# EAGLE design placa_servo2 (EAGLE 8.0.0)
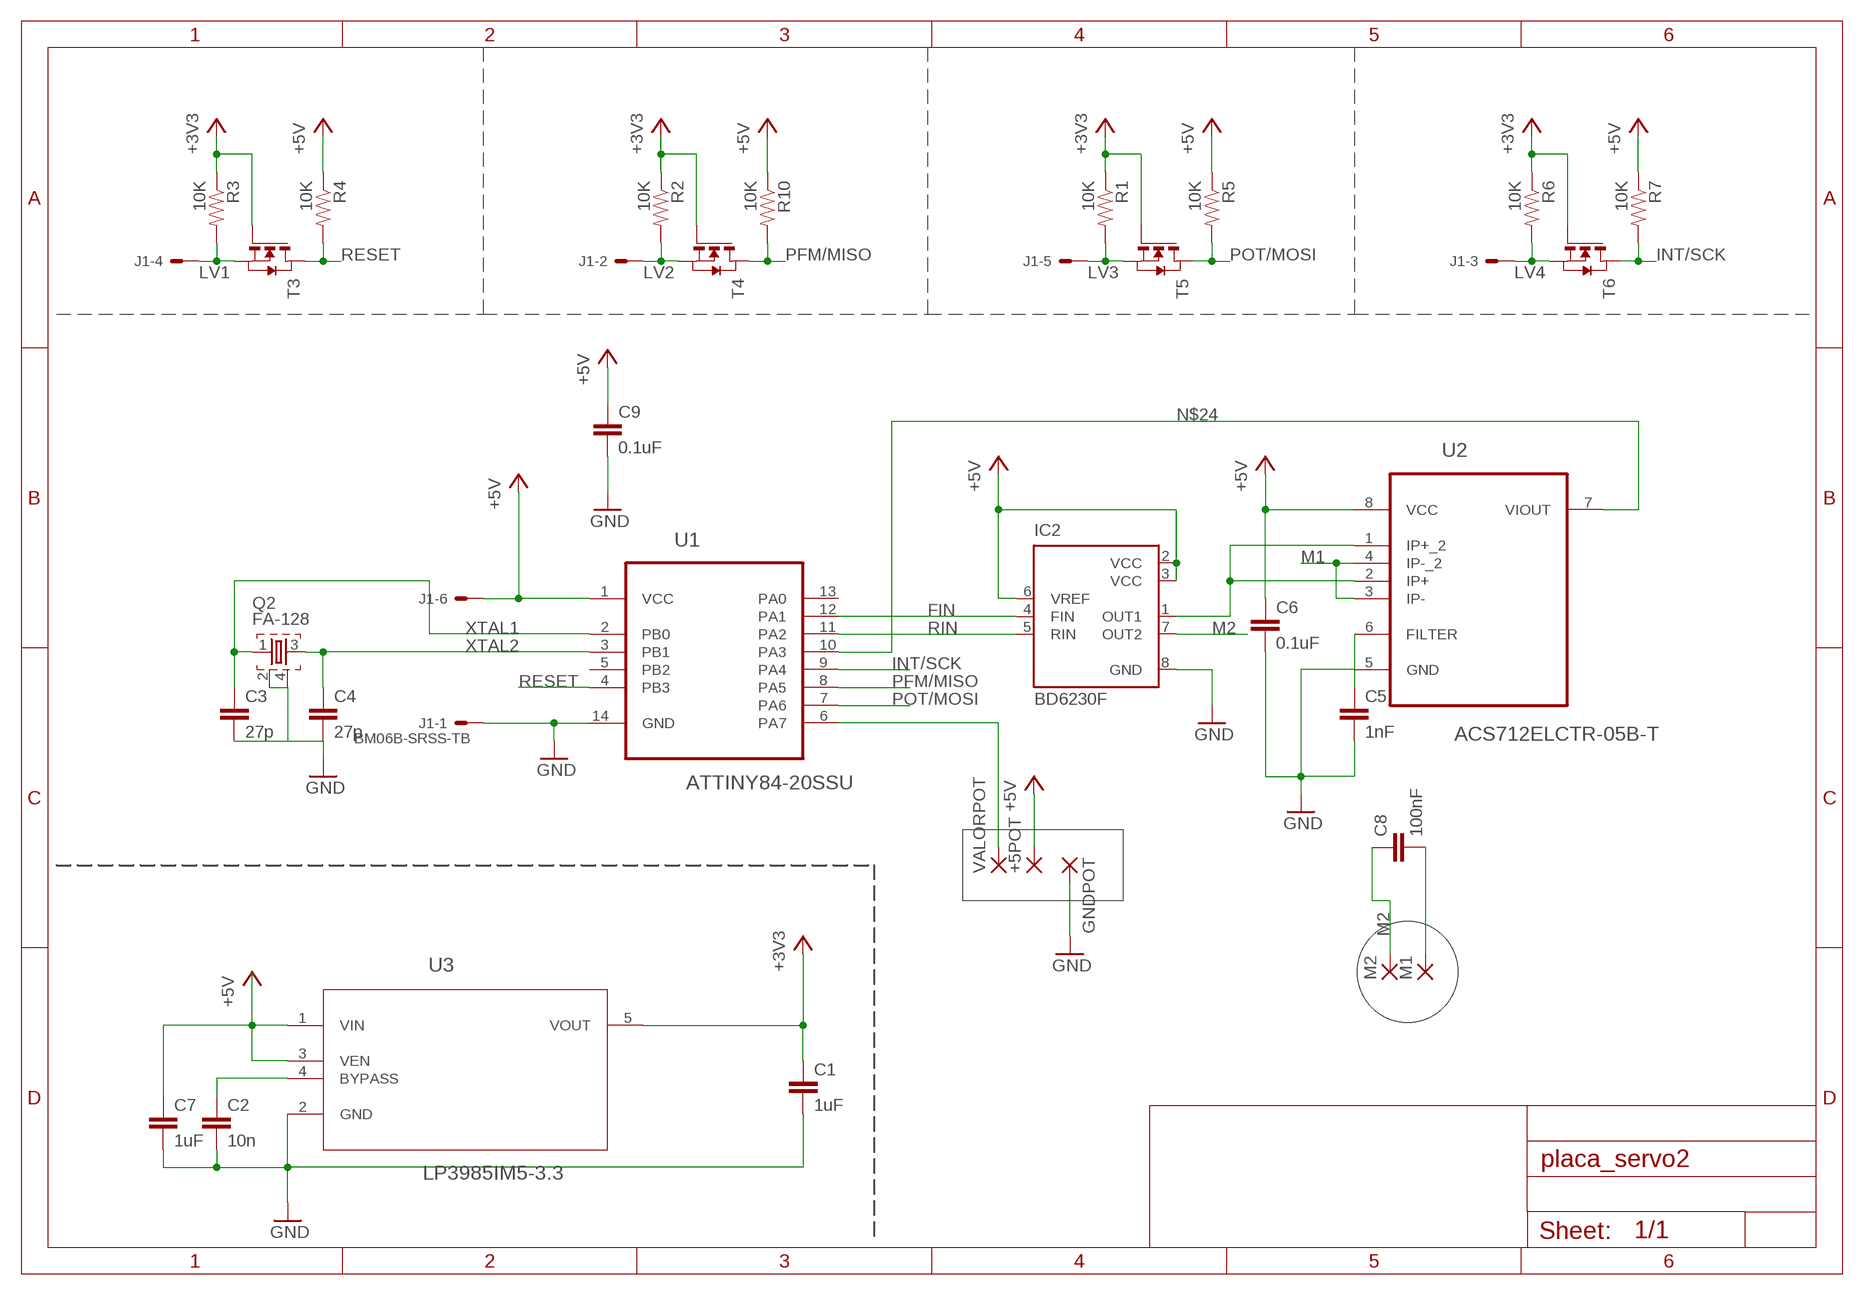
[diagram p0: schematic, sheet 1]

## Parts
+5POT  1,6/0,9  [1,6/0,9]
C1  1uF  C-EUC0603  [C0603]
C2  10n  C-EUC0603  [C0603]
C3  27p  C-EUC0603  [C0603]
C4  27p  C-EUC0603  [C0603]
C5  1nF  C-EUC0603  [C0603]
C6  0.1uF  C-EUC0603  [C0603]
C7  1uF  C-EUC0603  [C0603]
C8  100nF  C-EUC0603  [C0603]
C9  0.1uF  C-EUC0603  [C0603]
GNDPOT  1,6/0,9  [1,6/0,9]
IC2  BD6230F  [SOP8]
J1  BM06B-SRSS-TB  [BM06B-SRSS-TB]
M1  1,6/0,9  [1,6/0,9]
M2  1,6/0,9  [1,6/0,9]
Q2  FA-128  [FA-128]
R1  10K  RESISTOR0603-RES  [0603-RES]
R2  10K  RESISTOR0603-RES  [0603-RES]
R3  10K  RESISTOR0603-RES  [0603-RES]
R4  10K  RESISTOR0603-RES  [0603-RES]
R5  10K  RESISTOR0603-RES  [0603-RES]
R6  10K  RESISTOR0603-RES  [0603-RES]
R7  10K  RESISTOR0603-RES  [0603-RES]
R10  10K  RESISTOR0603-RES  [0603-RES]
T3  NMOSSOT23  [SOT-23]
T4  NMOSSOT23  [SOT-23]
T5  NMOSSOT23  [SOT-23]
T6  NMOSSOT23  [SOT-23]
U1  ATTINY84-20SSU  [SOIC127P600X175-14N]
U2  ACS712ELCTR-05B-T  [SOIC127P600X175-8N]
U3  LP3985IM5-3.3  [SOT95P300X120-5N]
VALORPOT  1,6/0,9  [1,6/0,9]

## Nets
+3V3: C1.1 R1.1 R2.1 R3.1 R6.1 T3.3(G) T4.3(G) T5.3(G) T6.3(G) U3.5(VOUT)
+5V: +5POT.1(P) C6.1 C7.1 C9.1 IC2.2(VCC) IC2.3(VCC) IC2.6(VREF) J1.6 R4.1 R5.1 R7.1 R10.1 U1.1(VCC) U2.8(VCC) U3.1(VIN) U3.3(VEN)
FIN: IC2.4(FIN) U1.12(PA1)
GND: C1.2 C2.2 C3.2 C4.2 C5.2 C6.2 C7.2 C9.2 GNDPOT.1(P) IC2.8(GND) J1.1 Q2.2 Q2.4 U1.14(GND) U2.5(GND) U3.2(GND)
INT/SCK: R7.2 T6.1(D) U1.9(PA4)
LV1: J1.4 R3.2 T3.2(S)
LV2: J1.2 R2.2 T4.2(S)
LV3: J1.5 R1.2 T5.2(S)
LV4: J1.3 R6.2 T6.2(S)
M1: C8.2 M1.1(P) U2.3(IP-) U2.4(IP-_2)
M2: C8.1 IC2.7(OUT2) M2.1(P)
N$1: C2.1 U3.4(BYPASS)
N$3: U1.6(PA7) VALORPOT.1(P)
N$4: IC2.1(OUT1) U2.1(IP+_2) U2.2(IP+)
N$24: U1.10(PA3) U2.7(VIOUT)
N$26: C5.1 U2.6(FILTER)
PFM/MISO: R10.2 T4.1(D) U1.8(PA5)
POT/MOSI: R5.2 T5.1(D) U1.7(PA6)
RESET: R4.2 T3.1(D) U1.4(PB3)
RIN: IC2.5(RIN) U1.11(PA2)
XTAL1: C3.1 Q2.1 U1.2(PB0)
XTAL2: C4.1 Q2.3 U1.3(PB1)
Unconnected: U1.5(PB2) U1.13(PA0)

## Library data of the parts
+5POT GNDPOT M1 M2 VALORPOT = wirepad:1,6/0,9: THROUGH-HOLE PAD
C1 C2 C5-C9 = rcl:C-EU: CAPACITOR, European symbol
C3 C4 = resistor:C-EU: CAPACITOR, European symbol
IC2 = rohm:BD623*F: H-bridge driver for brush motors Source: http://www.rohm.com/products/databook/motor/pdf/bd623x_series-e.pdf; MPN: BD6230F-E2; OC_FARNELL: 1716264; OC_NEWARK: 15R0529
J1 = con-jst:?M06B-SRSS-TB: Disconnectable Crimp style connector, 1.0mm pitch 6 contacts
Q2 = crystal:FA-: MHz RANGE CRYSTAL UNIT Source: Epson Toyocom
R1-R7 R10 = SparkFun:RESISTOR: Resistor Basic schematic elements and footprints for 0603, 1206, and PTH resistors.
T3-T6 = zetex:NMOSSOT23: MOS FET; OC_FARNELL: unknown; OC_NEWARK: unknown
U1 = Atmel_By_element14_Batch_1-00:ATTINY84-20SSU: 8-bit Microcontroller with Bytes In-System Programmable Flash; MPN: ATTINY84-20SSU; OC_FARNELL: 1636955; OC_NEWARK: 03P2040; PACKAGE: SOIC-14; SUPPLIER: Atmel
U2 = ALLEGRO_ACS712ELCTR-05B-T_SENSOR_CURRENT:ACS712ELCTR-05B-T: Linear Current Sensor; MPN: ACS712ELCTR-05B-T; OC_FARNELL: 1329623; OC_NEWARK: 27M3644; PACKAGE: SOIC-8; SUPPLIER: Allegro
U3 = LP3985IM_3.3:LP3985IM5-3.3: Low-Dropout CMOS Voltage Regulator; MPN: LP3985IM5-3.3; OC_FARNELL: 1469025; OC_NEWARK: 23K8224; PACKAGE: SOT-5; SUPPLIER: NationalSemiconductor

## Board
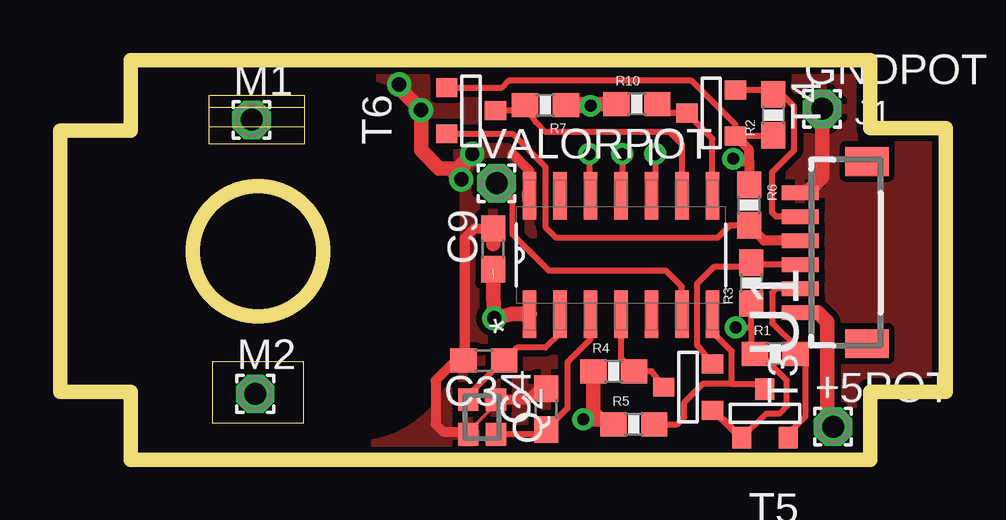
[diagram p1: board, top side]
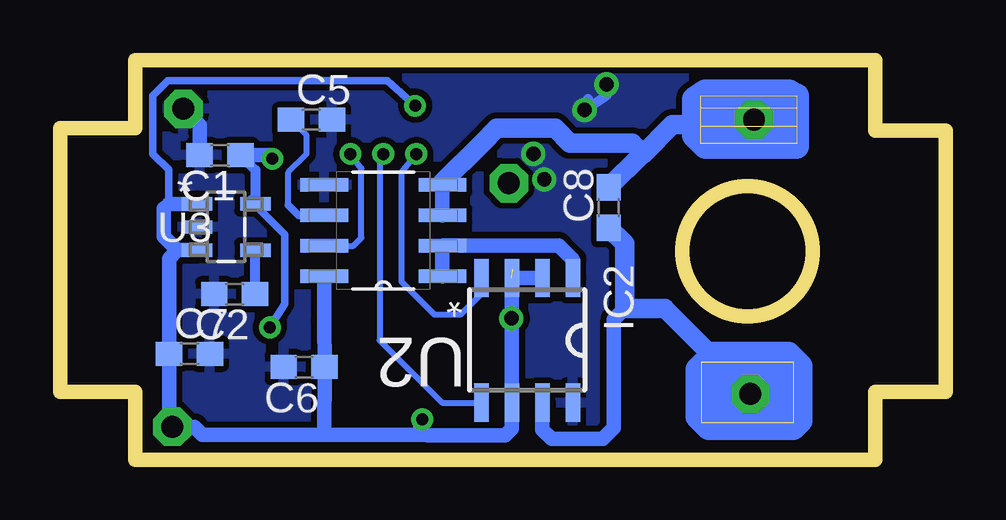
[diagram p2: board, bottom side, seen from below]

Size 36.9 x 16.68 mm. Coordinates in mm from the lower left corner, seen from the top.
Outline: 2.94,0 33.76,0 33.76,2.84 36.9,2.84 36.9,13.84 33.76,13.84 33.76,16.68 2.94,16.68 2.94,13.74 0,13.74 0,2.84 2.94,2.84 2.94,0
Outline: circle at 8.25,8.7 radius 2.7
Copper layers (1*16): Top 0.035mm / dielectric 1.5mm / Bottom 0.035mm
Design rules "default *": minimum track width 6mil, minimum drill 12mil, track to track 6mil, track to pad 6mil, pad to pad 6mil, via to via 6mil, smd to smd 6mil, copper to edge 6mil, drill to drill 6mil, minimum pad ring 10mil, minimum via ring 8mil, stop-mask expansion 4mil, vias tented up to drill 0mil, thermal gap 10mil

### Footprints (pad centres in the part's own frame; a part is rotated, then mirrored left to right if it is on the bottom)
1,6/0,9 = drill 0.914 pad 1.6 octagon: 1 0,0
C0603 = smd 1.1 x 1: 1 -0.85,0; 2 0.85,0
SOP8 = smd 0.6 x 1.6: 1 -1.905,-2.6; 2 -0.635,-2.6; 3 0.635,-2.6; 4 1.905,-2.6; 5 1.905,2.6; 6 0.635,2.6; 7 -0.635,2.6; 8 -1.905,2.6
BM06B-SRSS-TB = smd 0.6 x 1.55: 1 -2.5,-1.875; 2 -1.5,-1.875; 3 -0.5,-1.875; 4 0.5,-1.875; 5 1.5,-1.875; 6 2.5,-1.875 | smd 1.2 x 1.8: FIT@1 3.8,0.9; FIT@2 -3.8,0.9
FA-128 = smd 0.95 x 0.85: 1 -0.725,-0.575; 2 0.725,-0.575; 3 0.725,0.575; 4 -0.725,0.575
0603-RES = smd 1.1 x 1: 1 -0.85,0; 2 0.85,0
SOT-23 = smd 0.787 x 0.889: 1 0.025,-1.016; 2 -0.94,1.016; 3 0.991,1.016
SOIC127P600X175-14N = smd 1.981 x 0.559: 1 -2.464,3.81; 2 -2.464,2.54; 3 -2.464,1.27; 4 -2.464,0; 5 -2.464,-1.27; 6 -2.464,-2.54; 7 -2.464,-3.81; 8 2.464,-3.81; 9 2.464,-2.54; 10 2.464,-1.27; 11 2.464,0; 12 2.464,1.27; 13 2.464,2.54; 14 2.464,3.81
SOIC127P600X175-8N = smd 1.981 x 0.559: 1 -2.464,1.905; 2 -2.464,0.635; 3 -2.464,-0.635; 4 -2.464,-1.905; 5 2.464,-1.905; 6 2.464,-0.635; 7 2.464,0.635; 8 2.464,1.905
SOT95P300X120-5N = smd 1.27 x 0.559: 1 -1.219,0.965; 2 -1.219,0; 3 -1.219,-0.965; 4 1.219,-0.965; 5 1.219,0.965

### Placement (x,y rotation side)
+5POT  32.22,1.38 0 top
C1  30.23,12.71 180 bottom
C2  29.62,6.92 180 bottom
C3  17.66,4.15 180 top
C4  20.25,2.12 90 top
C5  26.42,14.18 0 bottom
C6  26.73,3.87 180 bottom
C7  31.5,4.43 0 bottom
C8  14.03,10.53 90 bottom
C9  18.04,8.8 90 top
GNDPOT  31.76,14.64 0 top
IC2  17.43,4.99 180 bottom
J1  32.72,8.65 270 top
M1  7.98,14.18 0 top
M2  8.14,2.75 0 top
Q2  17.58,1.79 270 top
R1  29.8,4.43 0 top
R2  29.73,14.39 90 top
R3  28.81,7.38 90 top
R4  23.07,3.69 0 top
R5  23.91,1.48 0 top
R6  28.71,10.63 270 top
R7  20.23,14.79 180 top
R10  24.04,14.84 0 top
T3  26.17,3.06 270 top
T4  27.14,14.49 270 top
T5  29.4,1.94 180 top
T6  17.13,14.54 90 top
U1  23.38,8.54 90 top
U2  23.43,9.56 180 bottom
U3  29.98,9.71 0 bottom
VALORPOT  18.19,11.54 0 top

### Tracks (layer width: path | path; a pad name or v marks a point on that pad's centre or on a via)
+3V3  (via drill 0.5)
  Top 0.254: T6.3 18.42,15.53 18.7,15.81 26.32,15.81 28.15,13.98 T4.3 29.53,13.5 R2.1 | 28.81,5.52 28.81,4.75 R1.1 29.27,4.33 30.28,3.31 30.28,2.25 29.98,1.94 29.45,1.94 29.42,1.91 T5.3 | 28.81,5.52 R3.1 | v28.15,5.52 28.81,5.52
  Top 0.305: T5.3 27.34,1.94 T3.3
  Top 0.406: 28.71,12.46 28.71,12.94 T4.3 | 28.71,12.46 R6.1 28.61,11.48 | v28.05,12.56 28.15,12.46 28.71,12.46
  Bottom 0.305: v28.15,5.52 27.54,6.51 27.54,9.41 28.76,10.63 U3.5
  Bottom 0.406: 28.93,10.84 U3.5 28.76,12.09 C1.1
  Bottom 0.61: C1.1 28.2,12.71 v28.05,12.56
+5V  (via drill 0.5, 0.6)  (1 unrouted)
  Top 0.61: R10.1 21.58,14.84 R7.1 21.1,14.77 v22.11,14.77 | 31.29,6.15 J1.6 31.57,6.15 31.96,5.75 31.96,1.74 31.91,1.69 +5POT.1 | 22.37,3.45 R4.1 22.22,1.98 22.51,1.69 | C9.1 18.04,6.87 v18.09,5.9 18.83,6.08 U1.1 | R5.1 22.86,1.69 22.51,1.69 | 22.51,1.69 v21.8,1.69
  Bottom 0.305: v22.11,14.77 23.27,15.81 32.42,15.81 33.03,15.2 33.03,12.76 32.37,12.1 32.37,10.68
  Bottom 0.61: 32.01,8.75 U3.3 | 32.01,8.75 32.35,8.41 C7.1 32.35,1.52 +5POT.1 31.3,1.38 30.97,1.05 25.89,1.05 | U3.1 32.37,10.68 32.57,10.47 32.57,9.31 32.01,8.75 | IC2.2 IC2.3 IC2.6 18.07,1.31 18.35,1.03 21.6,1.03 21.62,1.05 21.95,1.05 | U2.8 25.89,5.81 C6.1 25.86,3.86 25.89,1.05 | 21.95,1.05 25.89,1.05 | v21.8,1.69 21.95,1.05
FIN  (via drill 0.5)
  Top 0.254: v22.05,12.76 22.05,11.06 U1.12
  Bottom 0.254: IC2.4 19.34,6.94 20.23,6.06 21.29,6.06 22.66,7.43 22.66,12 v22.05,12.76
GND  (via drill 0.6)
  Top 0.152: Q2.4 18.16,2.31 17.01,1.16 Q2.2
  Top 0.406: v16.72,11.69 16.87,11.54 | 16.57,11.85 v16.72,11.69 | 17.03,12.61 v16.72,11.69 | U1.14 19.57,12.05 18.85,12.76 | Q2.4 19.49,2.51 19.95,2.97 C4.2 | C9.2 17.27,9.65 16.87,9.26 16.87,4.21 C3.2 16.49,4.15 15.65,3.31 15.65,1.48 15.96,1.18 16.89,1.18 Q2.2
  Top 0.61: C9.2 18.04,9 | 16.37,12.15 v16.72,11.69 | GNDPOT.1 31.76,11.8 31.11,11.15 J1.1 | v17.18,12.76 16.72,12.3 v16.72,11.69 | v14.13,15.66 14.13,15.5 v15.04,14.59 15.04,12.91 15.81,12.15 16.26,12.15 v16.72,11.69
  Bottom 0.406: 14.89,15.05 v15.04,14.59 14.13,15.2
  Bottom 0.61: C1.2 31.08,13.97 GNDPOT.1
  pour Bottom (isolate 0.254): -0.5,20.23 38.36,20.23 38.36,-2.48 -2.63,-2.48 -2.63,19.62 -2.63,20.23 -0.65,20.23
  pour Top (isolate 0.254): 11.54,18.4 37.9,18.4 37.9,-1.41 12.15,-1.41 12.15,0.57 arc90 16.87,5.29 16.87,10.93 arc90 11.54,16.27
INT/SCK
  Top 0.254: T6.1 19.3,14.56 R7.2 19.83,14.07 20.23,13.68 25.41,13.68 25.92,13.17 U1.9
LV1
  Top 0.254: 30.24,8.15 J1.4 28.88,8.15 R3.2 28.77,8.04 27.24,8.04 26.55,7.35 26.55,4.79 T3.2
LV2
  Top 0.254: J1.2 29.85,10.15 29.67,10.32 29.67,12 30.59,12.91 30.59,14.74 30.09,15.24 R2.2 29.38,15.43 T4.2
LV3
  Top 0.254: 30.46,7.15 J1.5 | J1.5 30.31,7.15 | T5.2 30.13,0.87 31.05,1.79 31.05,4.06 R1.2 | 30.74,4.21 R1.2 | R1.2 30.63,4.75 29.67,5.7 29.67,6.97 29.85,7.15 J1.5
LV4
  Top 0.254: 30.24,9.15 J1.3 | R6.2 27.91,9.78 27.39,9.26 20.68,9.26 20.23,9.71 20.23,12.23 18.85,13.6 T6.2
  Top 0.406: J1.3 29.34,9.15 R6.2
M1
  Bottom 0.61: U2.3 U2.4 20.96,11.57 | 12.61,12.76 13.06,13.22
  Bottom 0.813: 12.61,12.76 11.39,13.98 10.47,13.98 8.19,13.98 M1.1 | 20.96,11.57 19.31,13.22 18.7,13.83 16.26,13.83 15.65,13.22 13.06,13.22 12.61,12.76 | C8.2 12.64,12.76 12.61,12.76
  Bottom 1.016: 10.47,13.98 10.47,14.59 | 10.47,14.59 10.47,15.05 10.02,15.35 6.51,15.35 6.21,15.2 6.21,13.07 7.73,13.07 | 8.34,13.07 7.73,13.07 | 8.34,13.07 10.02,13.07 10.47,13.52 10.47,13.98 | 7.73,13.07 7.73,13.22 6.81,14.13 | 6.81,14.13 6.81,14.44 7.12,14.74 10.32,14.74 10.47,14.59 | 10.47,13.98 9.25,13.98 8.34,13.07 | M1.1 6.87,14.18 6.81,14.13
M2
  Bottom 0.61: IC2.7 16.8,1.25 16.42,0.87 14.28,0.87 13.83,1.33 13.83,5.87 13.37,6.32
  Bottom 0.813: M2.1 8.52,3.13 9.74,4.35 9.81,4.43 11.71,6.32 13.37,6.32 13.37,9.02 C8.1
  Bottom 1.016: 9.81,4.43 6.56,4.43 6.05,3.92 6.05,1.64 6.36,1.33 9.86,1.33 10.32,1.79 | 10.32,1.79 10.32,3.77 9.74,4.35 | 10.32,1.79 7.12,1.79 6.66,2.25 6.66,3.16 7.12,3.62 9.1,3.62 9.56,3.16 9.56,2.55 | 9.56,2.55 9.41,2.4 7.42,2.4 7.42,3.16 7.58,3.31 8.34,3.31 8.52,3.13 9.1,2.55 9.56,2.55
N$1
  Bottom 0.406: C2.1 28.77,8.73 U3.4
N$3
  Top 0.254: U1.6 25.92,7.22 25.26,7.88 20.38,7.88 18.85,9.41 18.85,10.88 VALORPOT.1
N$4
  Bottom 0.61: U2.1 U2.2 20.94,8.95 16.11,8.95 15.53,8.37 IC2.1
N$24  (via drill 0.5)
  Top 0.254: v24.8,12.76 24.8,11.16 U1.10
  Bottom 0.254: U2.7 24.67,8.93 24.34,9.26 24.34,12.15 v24.8,12.76
N$26
  Bottom 0.254: 27.39,10.63 27.39,12 26.63,12.76 26.63,13.54 C5.1
  Bottom 0.305: U2.6 26.96,10.2 27.39,10.63 | C5.1 27.39,14.07
PFM/MISO
  Top 0.254: R10.2 25.11,14.46 T4.1 27.19,13.4 U1.8
POT/MOSI
  Top 0.254: T5.1 29.12,3.16 28,3.16 | 28,3.16 26.78,3.16 26.02,2.4 26.02,1.79 25.71,1.48 R5.2 | 28,3.16 28,4.53 27.19,5.34 U1.7
RESET
  Top 0.254: T3.1 24.65,3.69 R4.2 23.38,4.24 U1.4
RIN  (via drill 0.5)
  Top 0.254: v23.43,12.76 23.43,11.06 U1.11
  Bottom 0.254: IC2.5 20.98,2.39 23.58,4.99 23.58,12.46 v23.43,12.76
XTAL1
  Top 0.254: U1.2 20.84,5.29 20.23,4.68 19.04,4.68 C3.1 18.13,3.81 17.01,2.69 Q2.1
XTAL2
  Top 0.254: 18.36,1.27 Q2.3 20.05,1.06 C4.1 21.14,2.16 21.14,4.07 22.11,5.04 U1.3

### Text on the board
Top: length-freq-ri. ulp